# Altium schematic sheet ShutdownDPDT-S02-Relay.SchDoc
size A4; SheetNumber: 2; SheetTotal: 2
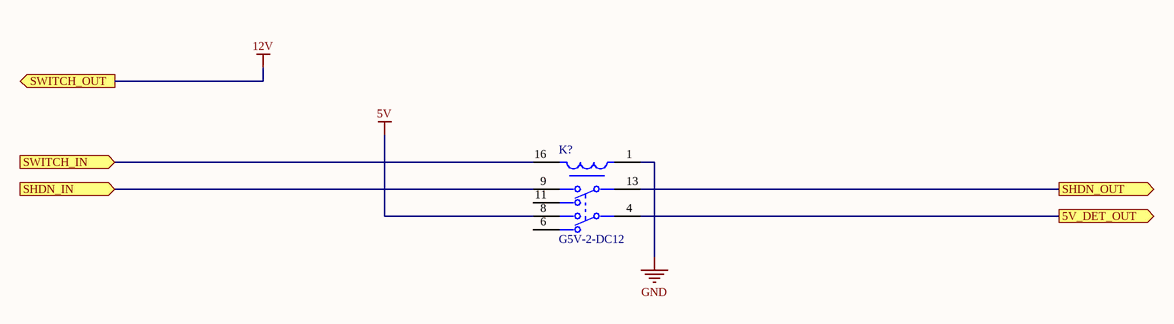
[diagram p0: ShutdownDPDT-S02-Relay.SchDoc]

## Parts
K?  G5V-2-DC12  [FP-G5V-2-DC12-MFG]

## Ports
5V_DET_OUT (out), SHDN_IN (in), SHDN_OUT (out), SWITCH_IN (in), SWITCH_OUT (out)

## Nets
5V: K?.8
12V: port SWITCH_OUT
GND: K?.1
5V_DET_OUT: K?.4 ; port 5V_DET_OUT
SHDN_IN: K?.9 ; port SHDN_IN
SHDN_OUT: K?.13 ; port SHDN_OUT
SWITCH_IN: K?.16 ; port SWITCH_IN

Not connected (* = marked no-connect by the designer): K? 6 11

## Library data of the parts
K? = CMP-08823-000082-1: RELAY GEN PURPOSE DPDT 2A 12VDC; Manufacturer Series: G5V-2; Relay Action: MOMENTARY; Coil Voltage (DC): 12V; Power Consumption: 500mW; Operate Time: 7ms; Reference Standard: UL; Relay Type: General Purpose; Voltage Rating (DC): 125V; Coil Current: 41.7mA; Coil Type: Non-Latching; Release Time: 3ms; Coil Resistance: 288R; Throw Configuration: DPDT; Depth: 10.1mm; Relay Function: DPDT; Mount: Through Hole; Current Rating: 2A; Number of Pins: 8; Weight: 5g; Coil Power: 500mW; Radiation Hardening: No; Case/Package: DIP; Series: G5V-2; Height: 11.5mm; Width: 10.1mm; Voltage Rating (AC): 125V; Approvals: UL; Contact Material: Gold; Max Current Rating: 2A; Max Operating Temperature: 65°C; Min Operating Temperature: -25°C; Contact Current Rating: 2A; Termination: PC Pin; Max Voltage Rating (DC): 125V; Lead Free: Lead Free; Max Voltage Rating (AC): 125V; Power Rating: 500mW; Type: Electromechanical; Packaging: Rail/Tube; Package Quantity: 25; Length: 20.5mm